# Altium schematic sheet ДФТВ.434519.003 л.2 Э3.SchDoc
size 420 x 297 mm; SheetNumber: 2; ListNumber: 1
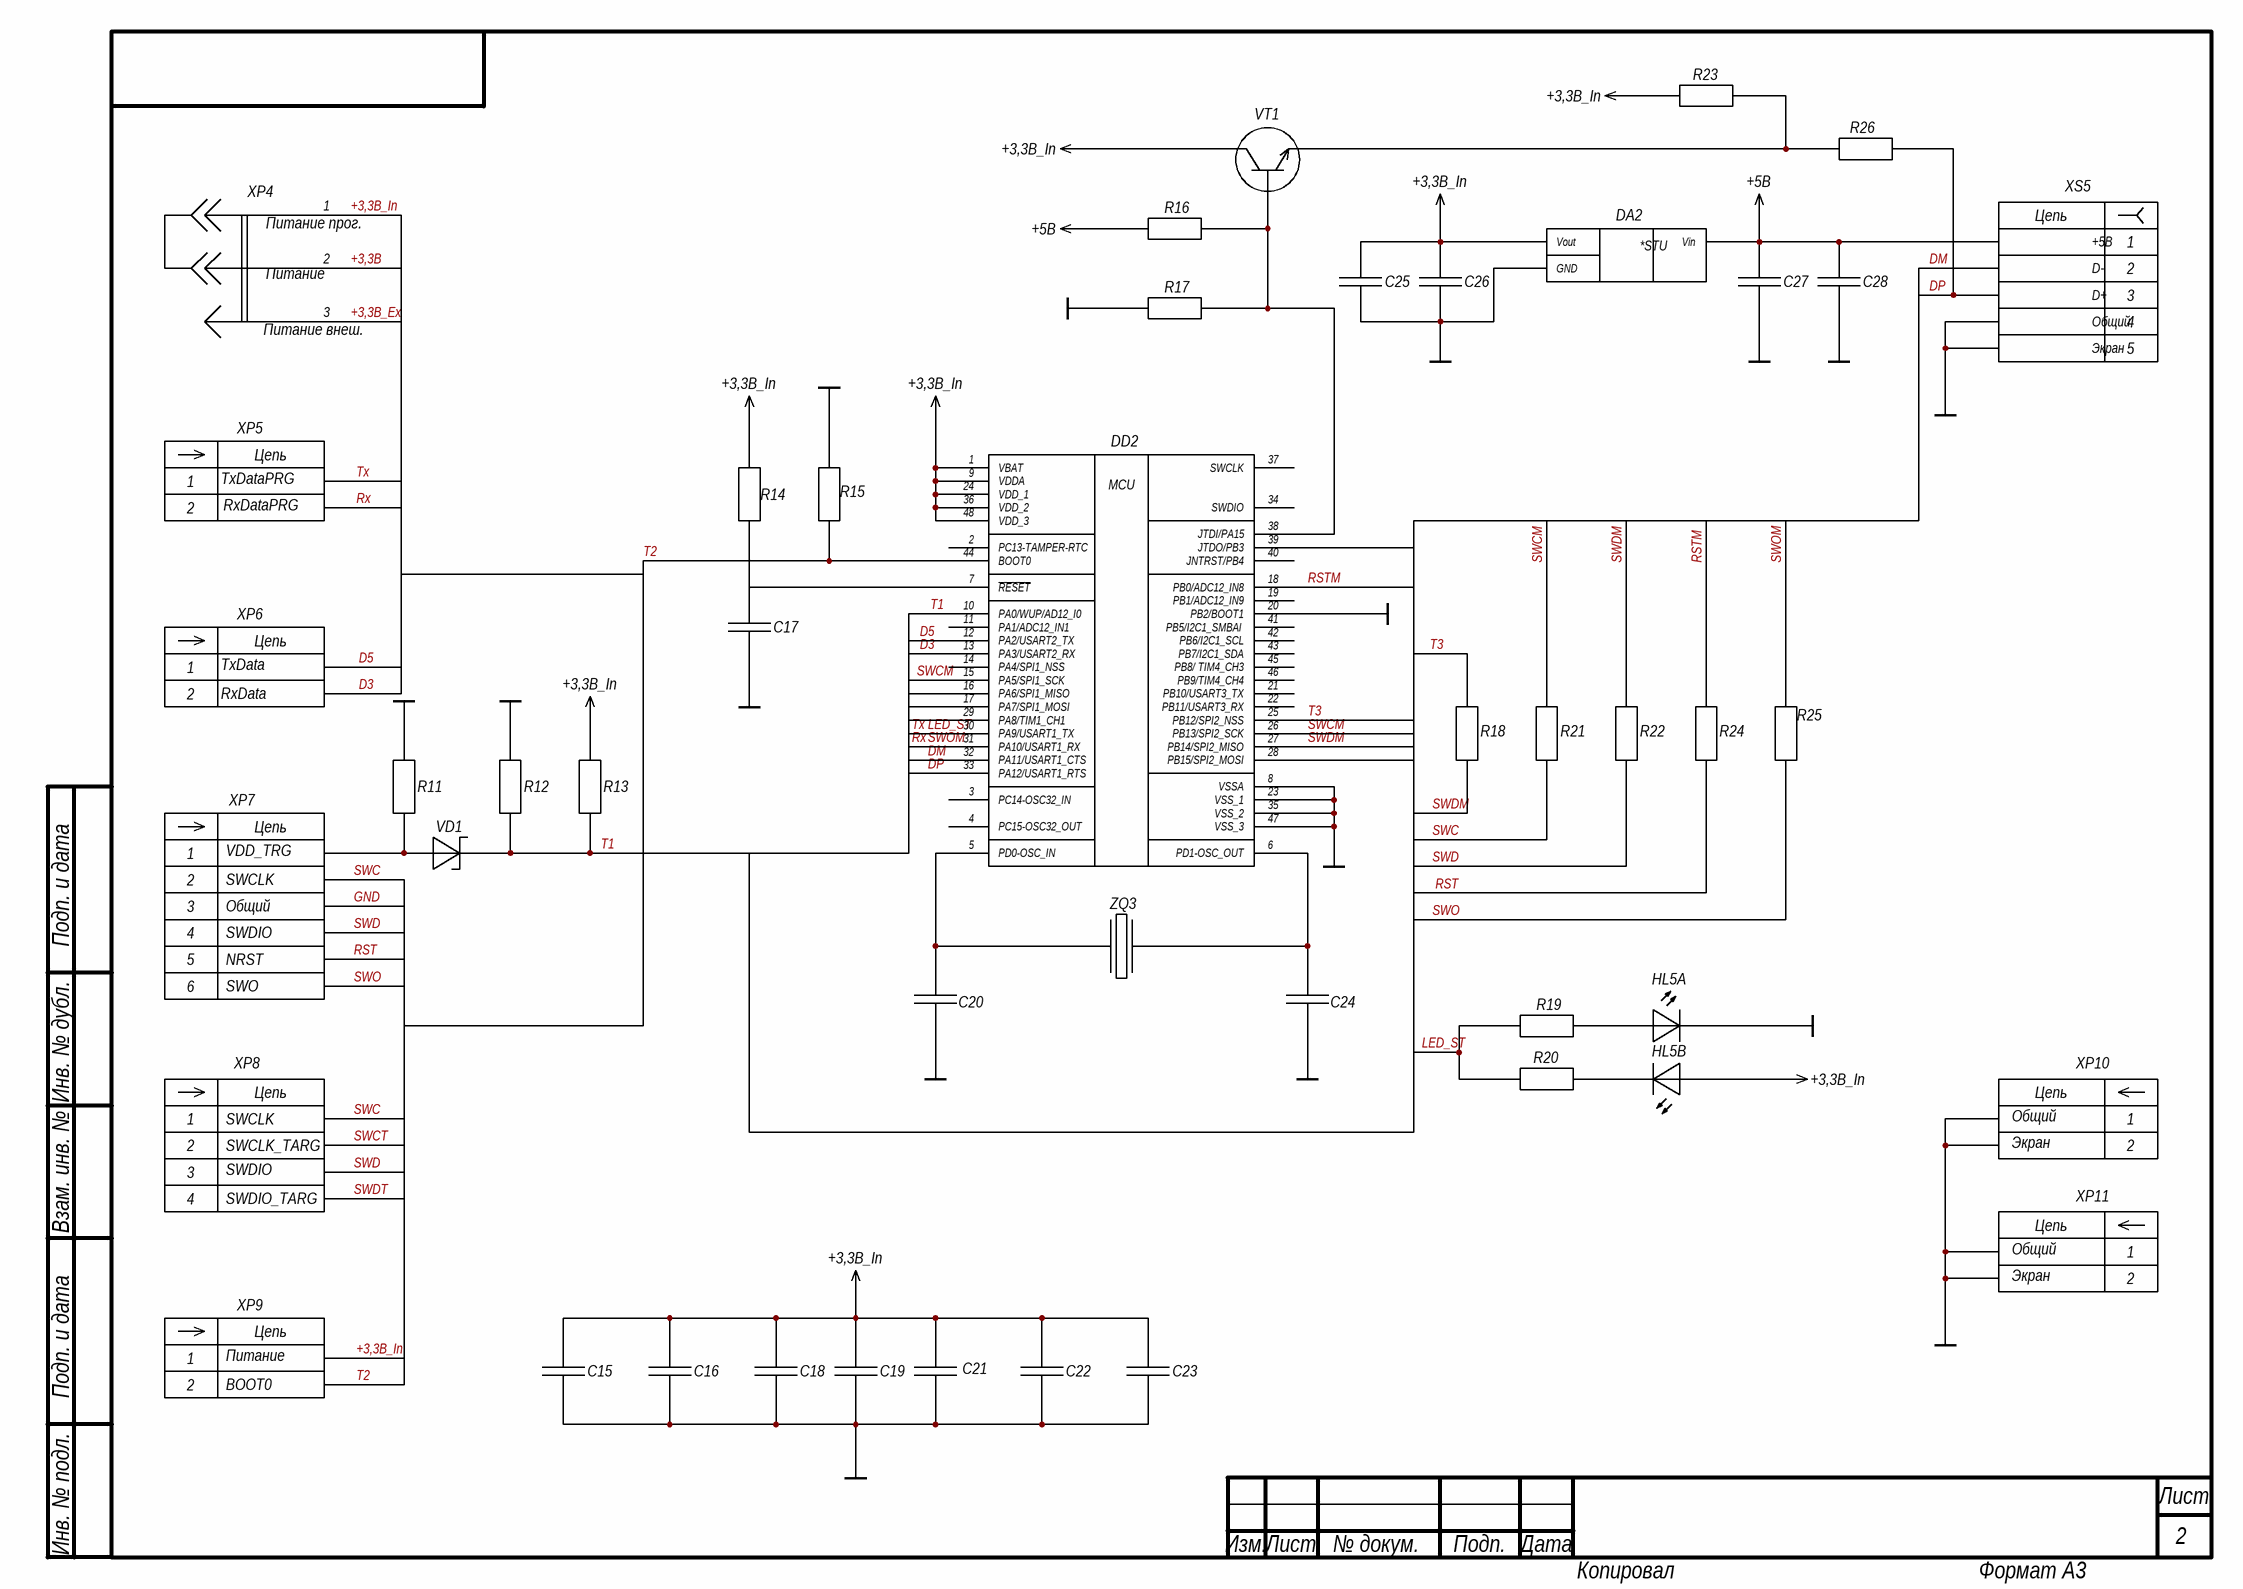
[diagram p0: ДФТВ.434519.003 л.2 Э3.SchDoc]

## Parts
C15  Конденсатор  [SMD_C0603]  (value not drawn)
C16  Конденсатор  [SMD_C0603]  (value not drawn)
C17  Конденсатор  [SMD_C0603]  (value not drawn)
C18  Конденсатор  [SMD_C0603]  (value not drawn)
C19  Конденсатор  [SMD_C0603]  (value not drawn)
C20  Конденсатор  [SMD_C0603]  (value not drawn)
C21  Конденсатор  [SMD_C0603]  (value not drawn)
C22  Конденсатор  [SMD_C0603]  (value not drawn)
C23  Конденсатор  [SMD_C0603]  (value not drawn)
C24  Конденсатор  [SMD_C0603]  (value not drawn)
C25  Конденсатор  [SMD_C0603]  (value not drawn)
C26  Конденсатор  [SMD_C0603]  (value not drawn)
C27  Конденсатор  [SMD_C0603]  (value not drawn)
C28  Конденсатор  [SMD_C0603]  (value not drawn)
DA2  Преобразователи напряжения  [SOT223]  (value not drawn)
DD2  Микроконтроллеры  [UFQFPN48]  (value not drawn)
HL5  Светодиод  [DIODE: LED 3528]  (value not drawn)  (parts A,B of 2)
R11  Резистор  [R0603]  (value not drawn)
R12  Резистор  [R0603]  (value not drawn)
R13  Резистор  [R0603]  (value not drawn)
R14  Резистор  [R0603]  (value not drawn)
R15  Резистор  [R0603]  (value not drawn)
R16  Резистор  [R0603]  (value not drawn)
R17  Резистор  [R0603]  (value not drawn)
R18  Резистор  [R0603]  (value not drawn)
R19  Резистор  [R0603]  (value not drawn)
R20  Резистор  [R0603]  (value not drawn)
R21  Резистор  [R0603]  (value not drawn)
R22  Резистор  [R0603]  (value not drawn)
R23  Резистор  [R0603]  (value not drawn)
R24  Резистор  [R0603]  (value not drawn)
R25  Резистор  [R0603]  (value not drawn)
R26  Резистор  [R0603]  (value not drawn)
VD1  Диод Шоттки  [DIODE: SOD323F]  (value not drawn)
VT1  Транзистор  [SOT23-3H]  (value not drawn)
XP4  Вилка  [PLS-3-J]  (value not drawn)
XP5  Вилка  [PLS-2]  (value not drawn)
XP6  Вилка  [PLS-2]  (value not drawn)
XP7  Вилка  [PLS-6]  (value not drawn)
XP8  Вилка  [PLS-4]  (value not drawn)
XP9  Вилка  [PLS-2]  (value not drawn)
XP10  Вилка  [PLS-2]  (value not drawn)
XP11  Вилка  [PLS-2]  (value not drawn)
XS5  Розетка  [USB_MINI_Type_b]  (value not drawn)
ZQ3  Кварцевые резонаторы  [HC-49S]  (value not drawn)

## Nets
+3,3В_In: C15.2 C16.2 C18.2 C19.2 C21.2 C22.2 C23.2 C25.2 C26.2 DA2.2(Vout) DD2.1(VBAT) DD2.9(VDDA) DD2.24(VDD_1) DD2.36(VDD_2) DD2.48(VDD_3) HL5.4 R13.2 R14.2 R23.2 VT1.3(К) XP4.1 XP9.1
+5В: C27.2 C28.2 DA2.3(Vin) R16.2 XS5.1
GND: C15.1 C16.1 C17.1 C18.1 C19.1 C20.1 C21.1 C22.1 C23.1 C24.1 C25.1 C26.1 C27.1 C28.1 DA2.1(GND) DD2.8(VSSA) DD2.20(PB2/BOOT1) DD2.23(VSS_1) DD2.35(VSS_2) DD2.47(VSS_3) HL5.1 R11.2 R12.2 R15.2 R17.2 XP7.3 XP10.1 XP10.2 XP11.1 XP11.2 XS5.4 XS5.5
+3,3В: XP4.2
+3,3В_Ex: XP4.3
D3: DD2.13(PA3/USART2_RX) XP6.2
D5: DD2.12(PA2/USART2_TX) XP6.1
DM: DD2.32(PA11/USART1_CTS) XS5.2
DP: DD2.33(PA12/USART1_RTS) R26.1 XS5.3
LED_ST: DD2.30(PA9/USART1_TX) R19.1 R20.1 XP5.1  [also labelled Tx]
RST: R24.2 XP7.5
RSTM: DD2.18(PB0/ADC12_IN8) R24.1
Rx: DD2.31(PA10/USART1_RX) R25.1 XP5.2  [also labelled SWOM]
SWC: R21.2 XP7.2 XP8.1
SWCM: DD2.15(PA5/SPI1_SCK) DD2.26(PB13/SPI2_SCK) R21.1
SWCT: XP8.2
SWD: R22.2 XP7.4 XP8.3
SWDM: DD2.27(PB14/SPI2_MISO) R18.2 R22.1
SWDT: XP8.4
SWO: R25.2 XP7.6
T1: DD2.10(PA0/WUP/AD12_I0) R12.1 R13.1 VD1.K
T2: DD2.44(BOOT0) R15.1 XP9.2
T3: DD2.25(PB12/SPI2_NSS) R18.1
NetC17_2: C17.2 DD2.7(~{RESET}) R14.1
NetC20_2: C20.2 DD2.5(PD0-OSC_IN) ZQ3.1
NetC24_2: C24.2 DD2.6(PD1-OSC_OUT) ZQ3.3
NetDD2_38: DD2.38(JTDI/PA15) R16.1 R17.1 VT1.1(Б)
NetHL5_2: HL5.2 R19.2
NetHL5_3: HL5.3 R20.2
NetR11_1: R11.1 VD1.A XP7.1
NetR23_1: R23.1 R26.2 VT1.2(Э)

Not connected (* = marked no-connect by the designer): DD2 2(PC13-TAMPER-RTC) 3(PC14-OSC32_IN) 4(PC15-OSC32_OUT) 11(PA1/ADC12_IN1) 14(PA4/SPI1_NSS) 16(PA6/SPI1_MISO) 17(PA7/SPI1_MOSI) 19(PB1/ADC12_IN9) 21(PB10/USART3_TX) 22(PB11/USART3_RX) 28(PB15/SPI2_MOSI) 29(PA8/TIM1_CH1) 34(SWDIO) 37(SWCLK) 39(JTDO/PB3) 40(JNTRST/PB4) 41(PB5/I2C1_SMBAl_) 42(PB6/I2C1_SCL) 43(PB7/I2C1_SDA) 45(PB8/_TIM4_CH3) 46(PB9/TIM4_CH4)

## Notes on the sheet
- (near XP4) Питание прог.
- (near XP4) Питание
- (near XP4) Питание внеш.
- (near XP5) TxDataPRG
- (near XP5) RxDataPRG
- (near XP6) TxData
- (near XP6) RxData
- (near XP7) VDD_TRG
- SWCLK
- Общий
- SWDIO
- NRST
- SWO
- (near XP10) Общий
- (near XP8) SWCLK_TARG
- (near XP8) SWDIO_TARG
- (near XP10) Экран
- (near XP11) Общий
- (near XP11) Экран
- (near XP9) Питание
- BOOT0
- Подп. и дата
- Инв. № дубл.
- Взам. инв. №
- Инв. № подл.
- Изм.
- Лист
- № докум.
- Подп.
- Дата
- Копировал
- Формат А3
- (in symbol AMS1117-3.3) *STU
- (in symbol Вилка 2 контакт) Цепь
- (in symbol Вилка 4 контакта) Цепь
- (in symbol Вилка 6 контактов) Цепь
- (in symbol Микроконтроллер STM32F103) MCU
- (in symbol Розетка USB mini) Цепь; +5В; D-; D+; Общий; Экран

## Library data of the parts
C15-C19 C21-C23 C25-C28 = Конденсаторы керамические: АДПК.673511.021 ТУ; Model: CL21B104JBCNNNC; Product Code: 34 1469; Component Name: К10-79-10В-0,1 мкФ+80/-20%-Н90; Value: 0.1 мкФ; Published: 18.05.2019; Publisher: АО НПО "КАДЕТЕК"; Distributer: АО НИИ "Гириконд"; TU/GOST: АДПК.673511.021 ТУ; Category: Конденсатор
C20 C24 = Конденсаторы керамические: АДПК.673511.021 ТУ; Model: CL21B104JBCNNNC; Product Code: 34 1469; Component Name: К10-79-100В-24 пФ±5%-МП0; Value: 24 пФ; Published: 18.05.2019; Publisher: АО НПО "КАДЕТЕК"; Distributer: АО НИИ "Гириконд"; TU/GOST: АДПК.673511.021 ТУ; Category: Конденсатор
DA2 = AMS1117-3.3: фирма Advanced Monolithic System; TU/GOST: ДВУК.431433.326-001ТУ; Product Code: 63 3300; Component Name: GM1117S-3.3ST3RG; Distributer: АО «Микрон»; Category: Преобразователи напряжения; Model: AMS1117-3.3
DD2 = Микроконтроллер STM32F103: фирма STMicroelectronics(ST); Model: STM32F103CBU6; Product Code: 63 3900; Distributer: АО "Чип и Дип"; Category: Микроконтроллеры; TU/GOST: фирма STMicroelectronics(ST); Component Name: STM32F103CBU6
HL5 = Светодиоды_сдвоенные: фирма Kingbright; Value: 2.1 V; Model: KAA-3528ESGC; Product Code: 63 1000; Published: 24-Mar-1999; LatestRevisionDate: 17-Jul-2002; LatestRevisionNote: Re-released for DXP Platform.; PackageReference: PIN2; Publisher: Altium Limited; Distributer: АО "Чип и Дип"; Category: Светодиод; TU/GOST: фирма Kingbright; Component Name: KAA-3528ESGC
R11 R14-R17 = Резисторы без указания рассеиваемой мощности: АЛЯР. 434110.005 ТУ; TU/GOST: АБШК.434110.023 ТУ; Product Code: 61 9900; Component Name: Р1-12-0,1-10 кОм±5%-М-"К"; Value: 10 кОм; Published: 8-Jun-2000; LatestRevisionDate: 17-Jul-2002; LatestRevisionNote: Re-released for DXP Platform.; PackageReference: AXIAL-0.4; Publisher: SPA CADETECH JSC; PackageDescription: Axial Device, Thru-Hole; 2 Leads; 0.4 in Pin Spacing; Model: R0603; Category: Резистор; Distributer: АО "НПО ЭРКОН"
R12 R13 = Резисторы без указания рассеиваемой мощности: АЛЯР. 434110.005 ТУ; TU/GOST: АБШК.434110.023 ТУ; Product Code: 61 9900; Component Name: Р1-12-0,1-4.7 кОм±5%-М-"К"; Value: 4.7 кОм; Published: 8-Jun-2000; LatestRevisionDate: 17-Jul-2002; LatestRevisionNote: Re-released for DXP Platform.; PackageReference: AXIAL-0.4; Publisher: SPA CADETECH JSC; PackageDescription: Axial Device, Thru-Hole; 2 Leads; 0.4 in Pin Spacing; Model: R0603; Category: Резистор; Distributer: АО "НПО ЭРКОН"
R18 = Резисторы без указания рассеиваемой мощности: АЛЯР. 434110.005 ТУ; TU/GOST: АБШК.434110.023 ТУ; Product Code: 61 9900; Component Name: Р1-12-0,1-220 Ом±5%-М-"К"; Value: 220 Ом; Published: 8-Jun-2000; LatestRevisionDate: 17-Jul-2002; LatestRevisionNote: Re-released for DXP Platform.; PackageReference: AXIAL-0.4; Publisher: SPA CADETECH JSC; PackageDescription: Axial Device, Thru-Hole; 2 Leads; 0.4 in Pin Spacing; Model: R0603; Category: Резистор; Distributer: АО "НПО ЭРКОН"
R19 R20 = Резисторы без указания рассеиваемой мощности: АЛЯР. 434110.005 ТУ; TU/GOST: АБШК.434110.023 ТУ; Product Code: 61 9900; Component Name: Р1-12-0,1-100 Ом±5%-М-"К"; Value: 100; Published: 8-Jun-2000; LatestRevisionDate: 17-Jul-2002; LatestRevisionNote: Re-released for DXP Platform.; PackageReference: AXIAL-0.4; Publisher: SPA CADETECH JSC; PackageDescription: Axial Device, Thru-Hole; 2 Leads; 0.4 in Pin Spacing; Model: R0603; Category: Резистор; Distributer: АО "НПО ЭРКОН"
R21 R22 R24 R25 = Резисторы без указания рассеиваемой мощности: АЛЯР. 434110.005 ТУ; TU/GOST: АБШК.434110.023 ТУ; Product Code: 61 9900; Component Name: Р1-12-0,1-22 Ом±5%-М-"К"; Value: 22 Ом; Published: 8-Jun-2000; LatestRevisionDate: 17-Jul-2002; LatestRevisionNote: Re-released for DXP Platform.; PackageReference: AXIAL-0.4; Publisher: SPA CADETECH JSC; PackageDescription: Axial Device, Thru-Hole; 2 Leads; 0.4 in Pin Spacing; Model: R0603; Category: Резистор; Distributer: АО "НПО ЭРКОН"
R23 R26 = Резисторы без указания рассеиваемой мощности: АЛЯР. 434110.005 ТУ; TU/GOST: АБШК.434110.023 ТУ; Product Code: 61 9900; Component Name: Р1-12-0,1-1.5 кОм±5%-М-"К"; Value: 1.5 кОм; Published: 8-Jun-2000; LatestRevisionDate: 17-Jul-2002; LatestRevisionNote: Re-released for DXP Platform.; PackageReference: AXIAL-0.4; Publisher: SPA CADETECH JSC; PackageDescription: Axial Device, Thru-Hole; 2 Leads; 0.4 in Pin Spacing; Model: R0603; Category: Резистор; Distributer: АО "НПО ЭРКОН"
VD1 = Диоды Шоттки: фирма ST Microelectronics; Rule: PcbType=ProtelPcb; Value: 40 V; Model: BAT60JFILM SOD323F; Product Code: 63 1000; Component Name: BAT60JFILM; Distributer: АО "Чип и Дип"; Category: Диод Шоттки; TU/GOST: фирма ST Microelectronics
VT1 = Биполярный NPN: фирма Nexperia; TU/GOST: АДКБ.432140.555; Value: NPN; Model: КТ3102БМ; Product Code: 63 1000; Characteristic: 45В, 0.1А, 0.25Вт, 100МГц, h21e=450; Component Name: КТ229Г9; Published: 20.04.2021; Publisher: АО "НПО КАДЕТЕК"; Type: Транзистор; Distributer: АО «ГРУППА КРЕМНИЙ ЭЛ»; Category: Транзистор
XP4 = Вилка 3 контакта перемычка_1_2: KLS electronic co ltd; TU/GOST: РЮМК.430420.051 ТУ; Product Code: 34 6430; Component Name: СНП393-3ВП21-1-01-6,5; Distributer: АО "КАРАЧЕВСКИЙ ЗАВОД "ЭЛЕКТРОДЕТАЛЬ"; Category: Вилка
XP5 XP6 XP9 = Вилка 2 контакт: Connfly electronic (Zhenqin); TU/GOST: РЮМК.430420.051 ТУ; Product Code: 34 6430; Component Name: СНП393-2ВП21-1-01-6,5; Distributer: АО "КАРАЧЕВСКИЙ ЗАВОД "ЭЛЕКТРОДЕТАЛЬ"; Category: Вилка
XP7 = Вилка 6 контактов: РЮМК.430420.047 ТУ; TU/GOST: РЮМК.430420.051 ТУ; Product Code: 34 6430; Component Name: СНП393-6ВП21-1-01-6,5; Distributer: АО "КАРАЧЕВСКИЙ ЗАВОД "ЭЛЕКТРОДЕТАЛЬ"; Category: Вилка
XP8 = Вилка 4 контакта: Connfly electronic (Zhenqin); TU/GOST: РЮМК.430420.051 ТУ; Product Code: 34 6430; Component Name: СНП393-4ВП21-1-01-6,5; Distributer: АО "КАРАЧЕВСКИЙ ЗАВОД "ЭЛЕКТРОДЕТАЛЬ"; Category: Вилка
XP10 XP11 = Вилка 2 контакт: Connfly electronic (Zhenqin); TU/GOST: РЮМК.430420.041 ТУ; Product Code: 34 6430; Component Name: СНП377-2ВП21-1-14-6,0; Distributer: АО "КАРАЧЕВСКИЙ ЗАВОД "ЭЛЕКТРОДЕТАЛЬ"; Category: Вилка
XS5 = Розетка USB mini: Фирма "Te Connectivity"; Product Code: 66 7250; Model: mini USB type B; Component Name: 1734035-1; Type: Розетка; TU/GOST: Фирма "Te Connectivity"; Distributer: АО "Чип и Дип"; Category: Розетка
ZQ3 = Кварцевые резонаторы: КЖДГ.433513.017 ТУ; Alternating Manufacture: Chequers Electronic Limited; Product Code: 63 2100; Model: HC49S; TU/GOST: ТУ 6321-002-72715118-2006; Value: 12 MHz; Component Name: РК415-5ДС-8М -3 (24 пФ); Published: 24.05.2021; Publisher: АО "НПО КАДЕТЕК"; Distributer: АО "ПЬЕЗО"; Category: Кварцевые резонаторы; Type: SMD07050C4